# Altium schematic sheet P05_BOOT SET_KEY_LED_SPI_ADC.SchDoc
size 420 x 297 mm
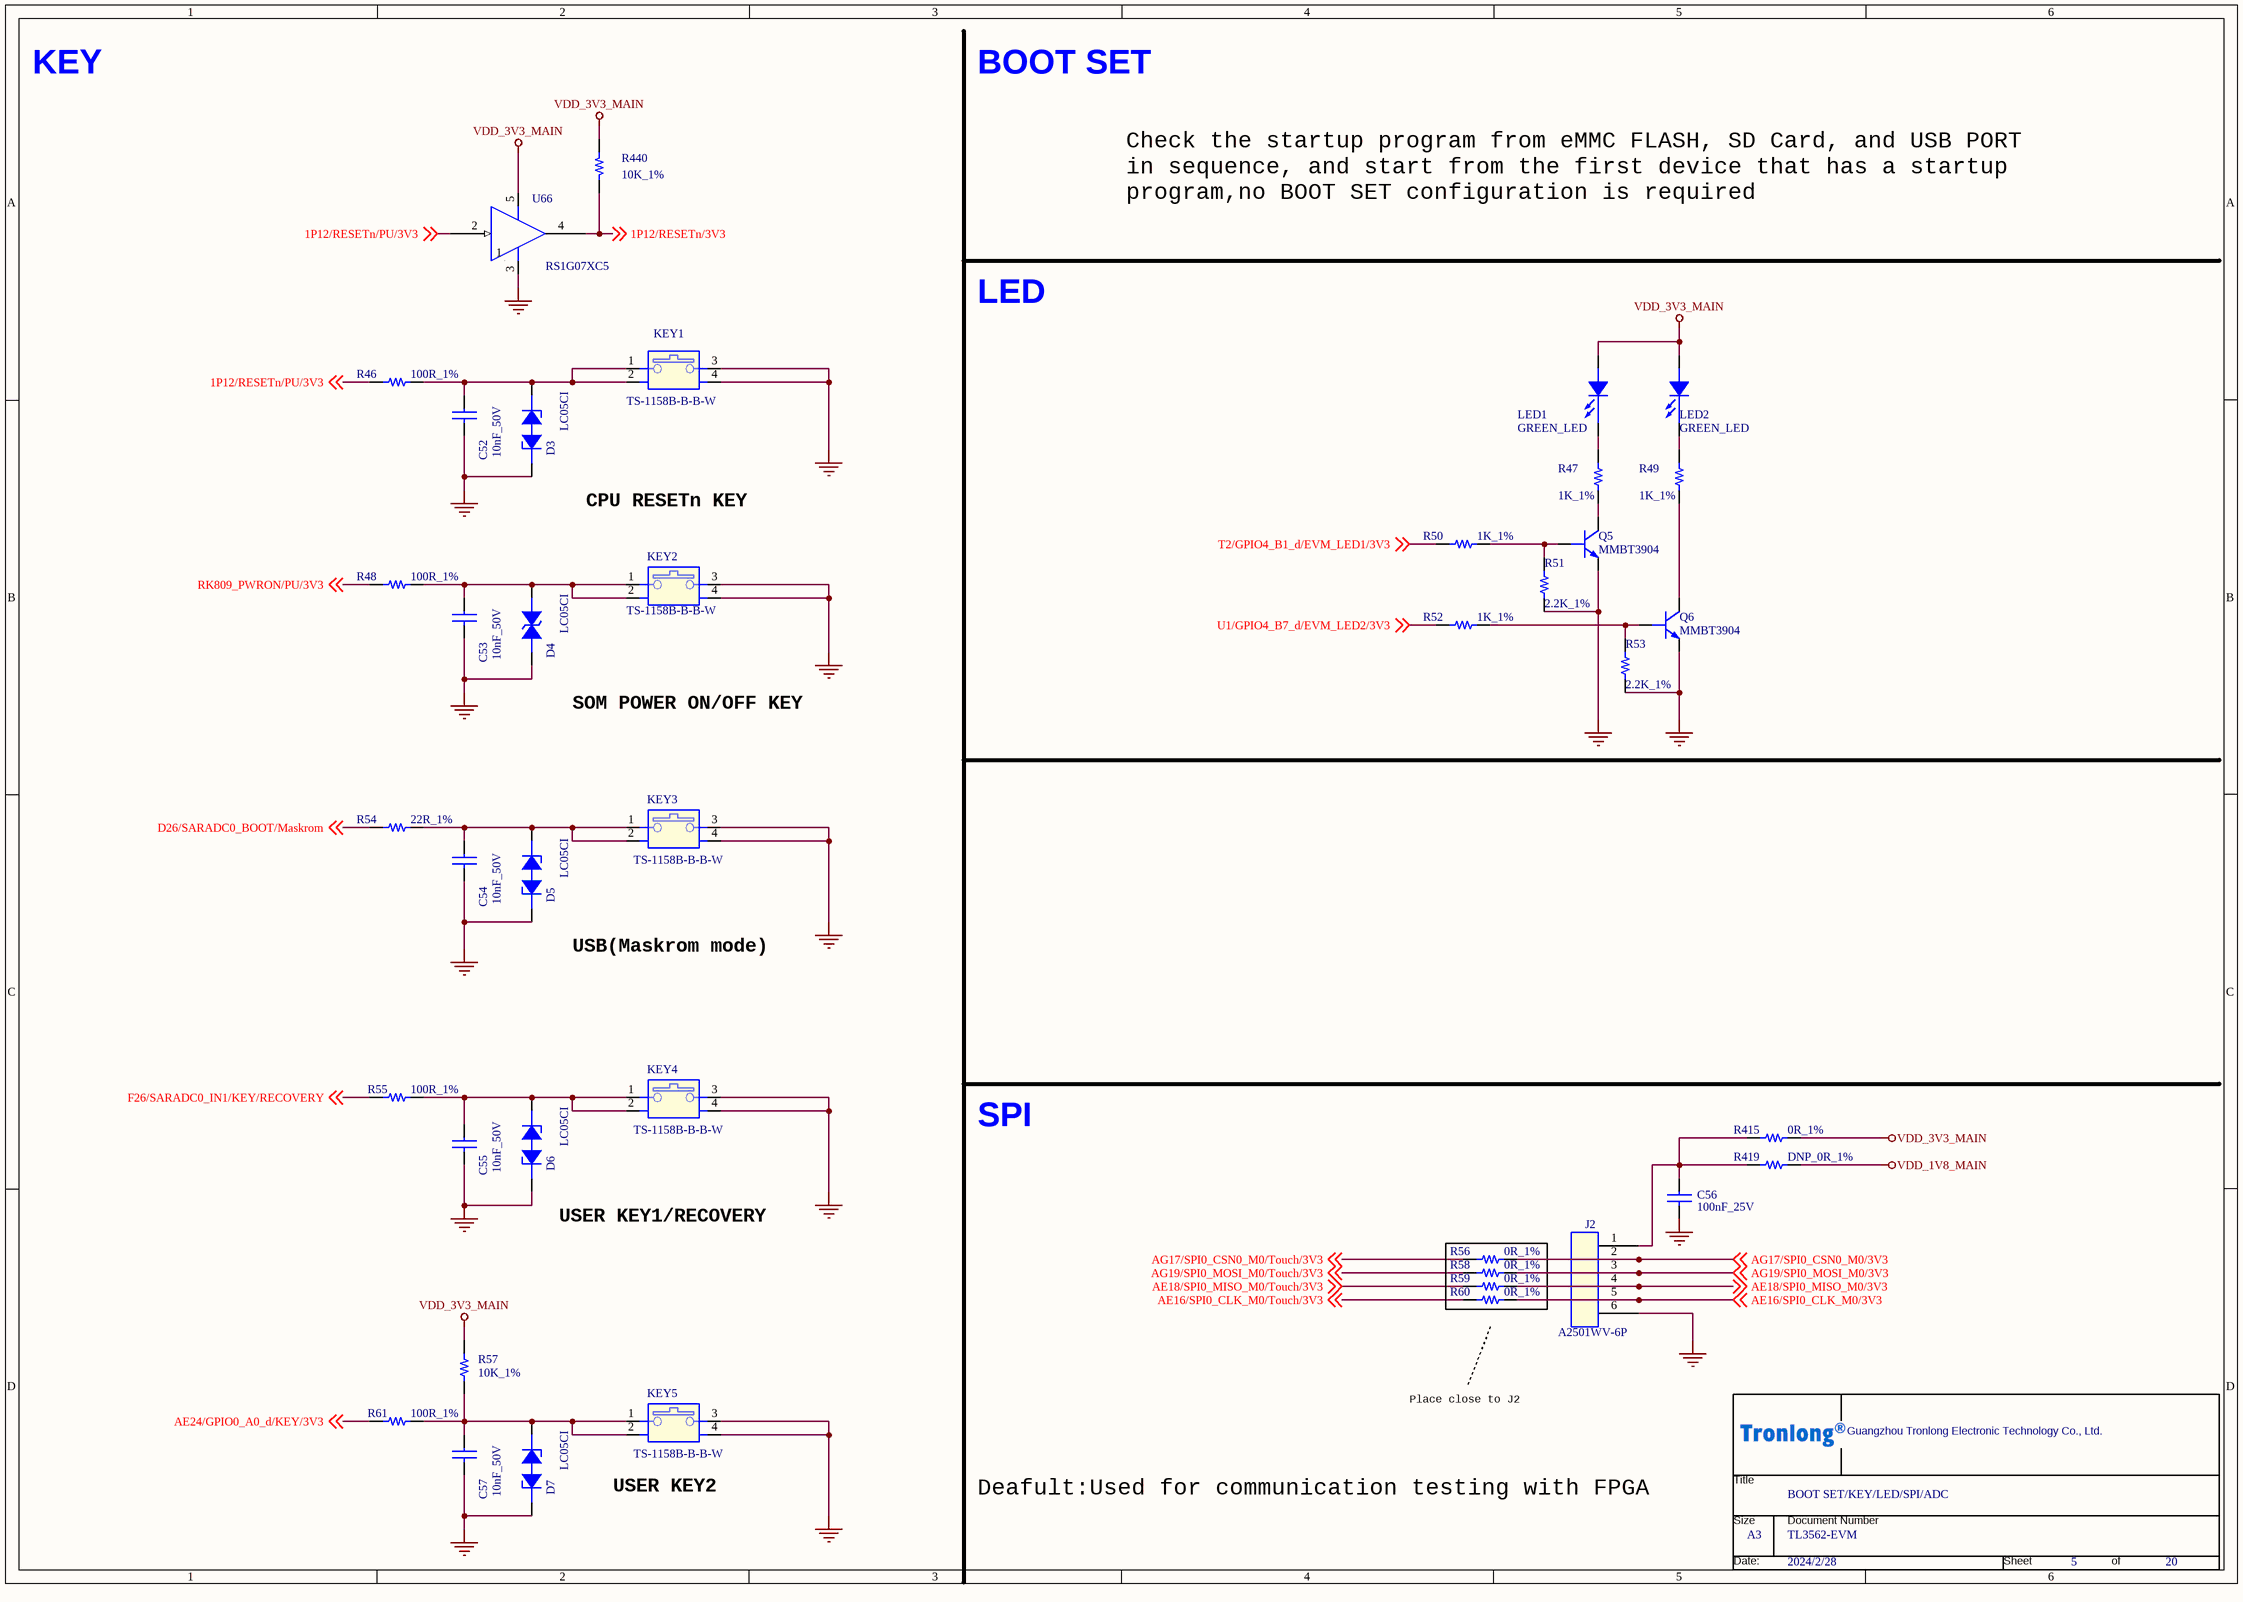
[diagram p0: P05_BOOT SET_KEY_LED_SPI_ADC.SchDoc]

## Parts
*  Page Count: 20  Page Number: 5  Page Size: A3  OrgName: Guangzhou Tronlong Electronic Technology Co., Ltd.  Title: BOOT SET/KEY/LED/SPI/ADC  Doc: TL3562-EVM  Page Modify Date: 2024/2/28  (hidden comment: Tronlong_TITTLE_20211115)  (graphical)
C52  10nF_50V  [C0402]
C53  10nF_50V  [C0402]
C54  10nF_50V  [C0402]
C55  10nF_50V  [C0402]
C56  100nF_25V  [C0402]
C57  10nF_50V  [C0402]
D3  LC05CI  [SOD323_BI]
D4  LC05CI  [SOD323_BI]
D5  LC05CI  [SOD323_BI]
D6  LC05CI  [SOD323_BI]
D7  LC05CI  [SOD323_BI]
J2  A2501WV-6P  [CON_XH_1x6P_2D54_H_M_DIP]
KEY1  TS-1158B-B-B-W  [TS-1158B-B-B-W]
KEY2  TS-1158B-B-B-W  [TS-1158B-B-B-W]
KEY3  TS-1158B-B-B-W  [TS-1158B-B-B-W]
KEY4  TS-1158B-B-B-W  [TS-1158B-B-B-W]
KEY5  TS-1158B-B-B-W  [TS-1158B-B-B-W]
LED1  GREEN_LED  [CON_2P_3MM]
LED2  GREEN_LED  [CON_2P_3MM]
Q5  MMBT3904  [SOT23-3_DBZ3]
Q6  MMBT3904  [SOT23-3_DBZ3]
R46  100R_1%  [R0603]
R47  1K_1%  [R0402]
R48  100R_1%  [R0603]
R49  1K_1%  [R0402]
R50  1K_1%  [R0402]
R51  2.2K_1%  [R0603]
R52  1K_1%  [R0402]
R53  2.2K_1%  [R0603]
R54  22R_1%  [R0402]
R55  100R_1%  [R0603]
R56  0R_1%  [R0402]
R57  10K_1%  [R0402]
R58  0R_1%  [R0402]
R59  0R_1%  [R0402]
R60  0R_1%  [R0402]
R61  100R_1%  [R0603]
R415  0R_1%  [R0603]
R419  DNP_0R_1%  [R0603]
R440  10K_1%  [R0402]
U66  RS1G07XC5  [SC70-5-43M]

## Nets
GND: C52.2 C53.2 C54.2 C55.2 C56.2 C57.2 D3.2(CATHODE2) D4.2 D5.2(CATHODE2) D6.2(CATHODE2) D7.2(CATHODE2) J2.6 KEY1.3 KEY1.4 KEY2.3 KEY2.4 KEY3.3 KEY3.4 KEY4.3 KEY4.4 KEY5.3 KEY5.4 Q5.2(E) Q6.2(E) R51.1 R53.1 U66.3(GND)
VDD_1V8_MAIN: R419.2
VDD_3V3_MAIN: LED1.1(CATHODE) LED2.1(CATHODE) R57.2 R415.2 R440.2 U66.5(VCC)
1P12/RESETn/3V3: R440.1 U66.4(Y) ; off-sheet 1P12/RESETn/3V3
1P12/RESETn/PU/3V3: R46.1 U66.2(A) ; off-sheet 1P12/RESETn/PU/3V3
AE16/SPI0_CLK_M0/3V3: J2.5 R60.2 ; off-sheet AE16/SPI0_CLK_M0/3V3
AE16/SPI0_CLK_M0/Touch/3V3: R60.1 ; off-sheet AE16/SPI0_CLK_M0/Touch/3V3
AE18/SPI0_MISO_M0/3V3: J2.4 R59.2 ; off-sheet AE18/SPI0_MISO_M0/3V3
AE18/SPI0_MISO_M0/Touch/3V3: R59.1 ; off-sheet AE18/SPI0_MISO_M0/Touch/3V3
AE24/GPIO0_A0_d/KEY/3V3: R61.1 ; off-sheet AE24/GPIO0_A0_d/KEY/3V3
AG17/SPI0_CSN0_M0/3V3: J2.2 R56.2 ; off-sheet AG17/SPI0_CSN0_M0/3V3
AG17/SPI0_CSN0_M0/Touch/3V3: R56.1 ; off-sheet AG17/SPI0_CSN0_M0/Touch/3V3
AG19/SPI0_MOSI_M0/3V3: J2.3 R58.2 ; off-sheet AG19/SPI0_MOSI_M0/3V3
AG19/SPI0_MOSI_M0/Touch/3V3: R58.1 ; off-sheet AG19/SPI0_MOSI_M0/Touch/3V3
D26/SARADC0_BOOT/Maskrom: R54.1 ; off-sheet D26/SARADC0_BOOT/Maskrom
F26/SARADC0_IN1/KEY/RECOVERY: R55.1 ; off-sheet F26/SARADC0_IN1/KEY/RECOVERY
RK809_PWRON/PU/3V3: R48.1 ; off-sheet RK809_PWRON/PU/3V3
T2/GPIO4_B1_d/EVM_LED1/3V3: R50.2 ; off-sheet T2/GPIO4_B1_d/EVM_LED1/3V3
U1/GPIO4_B7_d/EVM_LED2/3V3: R52.2 ; off-sheet U1/GPIO4_B7_d/EVM_LED2/3V3
NetC52_1: C52.1 D3.1(ANODE1) KEY1.1 KEY1.2 R46.2
NetC53_1: C53.1 D4.1 KEY2.1 KEY2.2 R48.2
NetC54_1: C54.1 D5.1(ANODE1) KEY3.1 KEY3.2 R54.2
NetC55_1: C55.1 D6.1(ANODE1) KEY4.1 KEY4.2 R55.2
NetC56_1: C56.1 J2.1 R415.1 R419.1
NetC57_1: C57.1 D7.1(ANODE1) KEY5.1 KEY5.2 R57.1 R61.2
NetLED1_2: LED1.2(ANODE) R47.2
NetLED2_2: LED2.2(ANODE) R49.2
NetQ5_1: Q5.1(B) R50.1 R51.2
NetQ5_3: Q5.3(C) R47.1
NetQ6_1: Q6.1(B) R52.1 R53.2
NetQ6_3: Q6.3(C) R49.1

Not connected (* = marked no-connect by the designer): U66 1(NC)

## Notes on the sheet
- KEY
- BOOT SET
- Check the startup program from eMMC FLASH, SD Card, and USB PORT
  in sequence, and start from the first device that has a startup
  program,no BOOT SET configuration is required
- LED
- CPU RESETn KEY
- SOM POWER ON/OFF KEY
- (near D5) USB(Maskrom mode)
- SPI
- (near D6) USER KEY1/RECOVERY
- Place close to J2
- (near KEY5) USER KEY2
- Deafult:Used for communication testing with FPGA
- (in symbol Tronlong_TITTLE_20211115) Title; Size; Document Number; Date:; Sheet; of

## Library data of the parts
* = Tronlong_TITTLE_20211115: RevCode: A?; Page Create Date: March  8, 1995
C52 C54 C57 = CAP NP_Dup2: 贴片陶瓷电容,10nF,10%,50V,X7R; Manufacturer Character: 中国大陆; As-Welded: /; Operation Temperature（℃）: -55~125℃; room: KEY; PCB Footprint: C0402
  C54 C57: Temperature: -55~125℃
C53 = CAP NP_Dup2: 贴片陶瓷电容,10nF,10%,50V,X7R; Manufacturer Character: 中国大陆; As-Welded: /; room: KEY; Operation Temperature（℃）: -55~125℃; PCB Footprint: C0402
C55 = CAP NP_Dup2: 贴片陶瓷电容,10nF,10%,50V,X7R; Manufacturer Character: 中国大陆; Operation Temperature（℃）: -55~125℃; room: KEY; As-Welded: /; Temperature: -55~125℃; PCB Footprint: C0402
C56 = CAP NP_Dup3: 贴片陶瓷电容,100nF,10%,25V,X5R; Manufacturer Character: 中国大陆; As-Welded: /; Operation Temperature（℃）: -55~85℃; PCB Footprint: C0402
D3 = DIODE BREAKDOWN_2: TVS二极管,VRWM=5V,VBR=6V,一组,双向,30KV,30KV; Manufacturer Part Number: PESD3V3L1BA; Manufacturer: 上海雷卯电子科技有限公司（Leiditech）; Manufacturer Character: 中国大陆; As-Welded: /; Operation Temperature（℃）: -55~125℃; room: KEY; Temperature: -55~155℃; Manufacturer PartNumber: LC05CI; PCB Footprint: SOD323_BI
D4 = DIODE-BI: TVS二极管,VRWM=5V,VBR=6V,一组,双向,30KV,30KV; Manufacturer Part Number: PESD3V3L1BA; Manufacturer: 上海雷卯电子科技有限公司（Leiditech）; Manufacturer Character: 中国大陆; As-Welded: /; Operation Temperature（℃）: -55~125℃; room: KEY; Temperature: -55~155℃; Manufacturer PartNumber: LC05CI; PCB Footprint: SOD323_BI
D5 D7 = DIODE BREAKDOWN_2: TVS二极管,VRWM=5V,VBR=6V,一组,双向,30KV,30KV; Manufacturer: 上海雷卯电子科技有限公司（Leiditech）; Manufacturer Part Number: PESD3V3L1BA; Manufacturer Character: 中国大陆; As-Welded: /; Operation Temperature（℃）: -55~125℃; room: KEY; Temperature: -60~150℃; Manufacturer PartNumber: LC05CI; PCB Footprint: SOD323_BI
D6 = DIODE BREAKDOWN_2: TVS二极管,VRWM=5V,VBR=6V,一组,双向,30KV,30KV; Manufacturer Character: 中国大陆; Manufacturer Part Number: PESD3V3L1BA; Manufacturer: 上海雷卯电子科技有限公司（Leiditech）; As-Welded: /; room: KEY; Operation Temperature（℃）: -55~125℃; Manufacturer PartNumber: LC05CI; Temperature: -60~150℃; PCB Footprint: SOD323_BI
J2 = CON6_Dup1: XH2.54  6P 连接器 180度; Manufacturer: 深圳市长江连接器有限公司（CJT）; Manufacturer Character: 中国大陆; Operation Temperature（℃）: -25~85℃; As-Welded: /; PCB Footprint: CON_XH_1x6P_2D54_H_M_DIP; Temperature: -25~85℃; Manufacturer PartNumber: A2501WV-6P
KEY1 = SW PUSHBUTTON-SPST SHIELD_0: 四脚方形按键6.4x6.5，2.5mm+1.8mm，白色硅胶键帽; Manufacturer Character: 中国大陆; Manufacturer: 广东星坤科技股份有限公司（XKB）; As-Welded: /; Operation Temperature（℃）: -40~85℃; Manufacturer PartNumber: TS-1158B-B-B-W; PCB Footprint: TS-1158B-B-B-W
KEY2 = SW PUSHBUTTON-SPST SHIELD_0: 四脚方形按键6.4x6.5，2.5mm+1.8mm，白色硅胶键帽; Manufacturer Character: 中国大陆; Manufacturer: 广东星坤科技股份有限公司（XKB）; As-Welded: /; Operation Temperature（℃）: -40~85℃; room: KEY; Manufacturer PartNumber: TS-1158B-B-B-W; Temperature: -40~85℃; PCB Footprint: TS-1158B-B-B-W
KEY3 KEY5 = SW PUSHBUTTON-SPST SHIELD_0: 四脚方形按键6.4x6.5，2.5mm+1.8mm，白色硅胶键帽; Manufacturer: 广东星坤科技股份有限公司（XKB）; Manufacturer Character: 中国大陆; As-Welded: /; room: KEY; Operation Temperature（℃）: -40~85℃; Manufacturer PartNumber: TS-1158B-B-B-W; PCB Footprint: TS-1158B-B-B-W
KEY4 = SW PUSHBUTTON-SPST SHIELD_0: 四脚方形按键6.4x6.5，2.5mm+1.8mm，白色硅胶键帽; Manufacturer Character: 中国大陆; Manufacturer: 广东星坤科技股份有限公司（XKB）; Operation Temperature（℃）: -40~85℃; room: KEY; As-Welded: /; Manufacturer PartNumber: TS-1158B-B-B-W; PCB Footprint: TS-1158B-B-B-W
LED1 = LED_0: 直插式发光二极管,绿色,带灯座; Manufacturer Character: 中国大陆; Manufacturer: 深圳市巨弘光电有限公司（JUHLIGHT）; Manufacturer PartNumber: JH-03B2YG1E-DL; As-Welded: /; Operation Temperature（℃）: -40~100℃; Temperature: -40~105℃; PCB Footprint: CON_2P_3MM
LED2 = LED_0: 直插式发光二极管,绿色,带灯座; Manufacturer PartNumber: JH-03B2YG1E-DL; Manufacturer: 深圳市巨弘光电有限公司（JUHLIGHT）; Manufacturer Character: 中国大陆; As-Welded: /; Operation Temperature（℃）: -40~100℃; Temperature: -40~105℃; PCB Footprint: CON_2P_3MM
Q5 Q6 = MMBT3904/SOT: BJT,NPN,Vceo=40V,Ic=200mA,fT=300MHz,PD=200mW; Manufacturer: 江苏长晶科技有限公司（JSCJ）; Manufacturer Character: 中国大陆; As-Welded: /; Operation Temperature（℃）: -55~150℃; Manufacturer PartNumber: MMBT3904; Temperature: -55~150℃; PCB Footprint: SOT23-3_DBZ3
R46 R48 = Resistor_Dup2: 贴片电阻,100R,±1%,1/10W; Manufacturer Character: 中国大陆; CLASS: DISCRETE; As-Welded: /; Operation Temperature（℃）: -55~155℃; room: JTAG; Temperature: -55~155℃; PCB Footprint: R0603
R47 R49 R50 R52 = Resistor_Dup3: 贴片电阻,1K,±1%,1/16W; Manufacturer Character: 中国大陆; CLASS: DISCRETE; Operation Temperature（℃）: -55~155℃; As-Welded: /; PCB Footprint: R0402
R51 R53 = Resistor_Dup3: 贴片电阻,2.2K,±1%,1/10W; Manufacturer Character: 中国大陆; CLASS: DISCRETE; Operation Temperature（℃）: -55~155℃; As-Welded: /; PCB Footprint: R0603
R54 = Resistor_Dup2: 贴片电阻,22R,±1%,1/16W; Manufacturer Character: 中国大陆; CLASS: DISCRETE; Operation Temperature（℃）: -55~155℃; room: JTAG; As-Welded: /; Temperature: -55~155℃; PCB Footprint: R0402
R55 R61 = Resistor_Dup2: 贴片电阻,100R,±1%,1/10W; Manufacturer Character: 中国大陆; CLASS: DISCRETE; Operation Temperature（℃）: -55~155℃; As-Welded: /; Temperature: -55~155℃; PCB Footprint: R0603
R56 R59 R60 = Resistor_Dup3: 0R,±1%,R0402,≥1/16W; Manufacturer Character: 中国大陆; CLASS: DISCRETE; As-Welded: /; room: 10; Operation Temperature（℃）: -55~155℃; PCB Footprint: R0402
R57 = Resistor_Dup2: 贴片电阻,10K,±1%,1/16W; Manufacturer Character: 中国大陆; CLASS: DISCRETE; Operation Temperature（℃）: -55~155℃; room: KEY; As-Welded: /; Temperature: -55~125℃; PCB Footprint: R0402
R58 = Resistor_Dup3: 0R,±1%,R0402,≥1/16W; Manufacturer Character: 中国大陆; CLASS: DISCRETE; As-Welded: /; Operation Temperature（℃）: -55~155℃; room: 10; PCB Footprint: R0402
R415 = Resistor_Dup3: 0R,±1%,R0603,≥1/10W; Manufacturer Character: 中国大陆; CLASS: DISCRETE; Operation Temperature（℃）: -55~155℃; room: RGMII1; As-Welded: /; Temperature: -55~125℃; PCB Footprint: R0603
R419 = Resistor_Dup3: 贴片电阻,0R,±1%,1/10W; Manufacturer Character: 中国大陆; CLASS: DISCRETE; Operation Temperature（℃）: -55~155℃; room: RGMII1; As-Welded: DNP; PCB Footprint: R0603; Temperature: -55~125℃
R440 = Resistor: 贴片电阻,10K,±1%,1/16W; Manufacturer Character: 中国大陆; CLASS: DISCRETE; Operation Temperature（℃）: -55~155℃; room: eth0; As-Welded: /; Temperature: -55~155℃; PCB Footprint: R0402
U66 = 1A_SN74LVC1G07: 1个1位缓冲器; PartName: SN74LVC1G07DCK; Mfr: TI; TIIntPartnumber: 1A0269; Manufacturer: 江苏润石科技有限公司（RUNIC）; Manufacturer Character: 中国大陆; Vendor: Digikey; Cost100: 1.11; Cost10K: 0.04; PCB Footprint: smd_dck5pin; DescriptiveText: Driver Open Drain output; Operation Temperature（℃）: -40~125℃; Remark: 单路开漏输出缓冲器/驱动器; MfrNum: SN74LVC1G07DCK; Temperature: -40~125℃; Manufacturer PartNumber: RS1G07XC5